# EAGLE schematic darpa-ee-adapter (EAGLE 9.3.2)
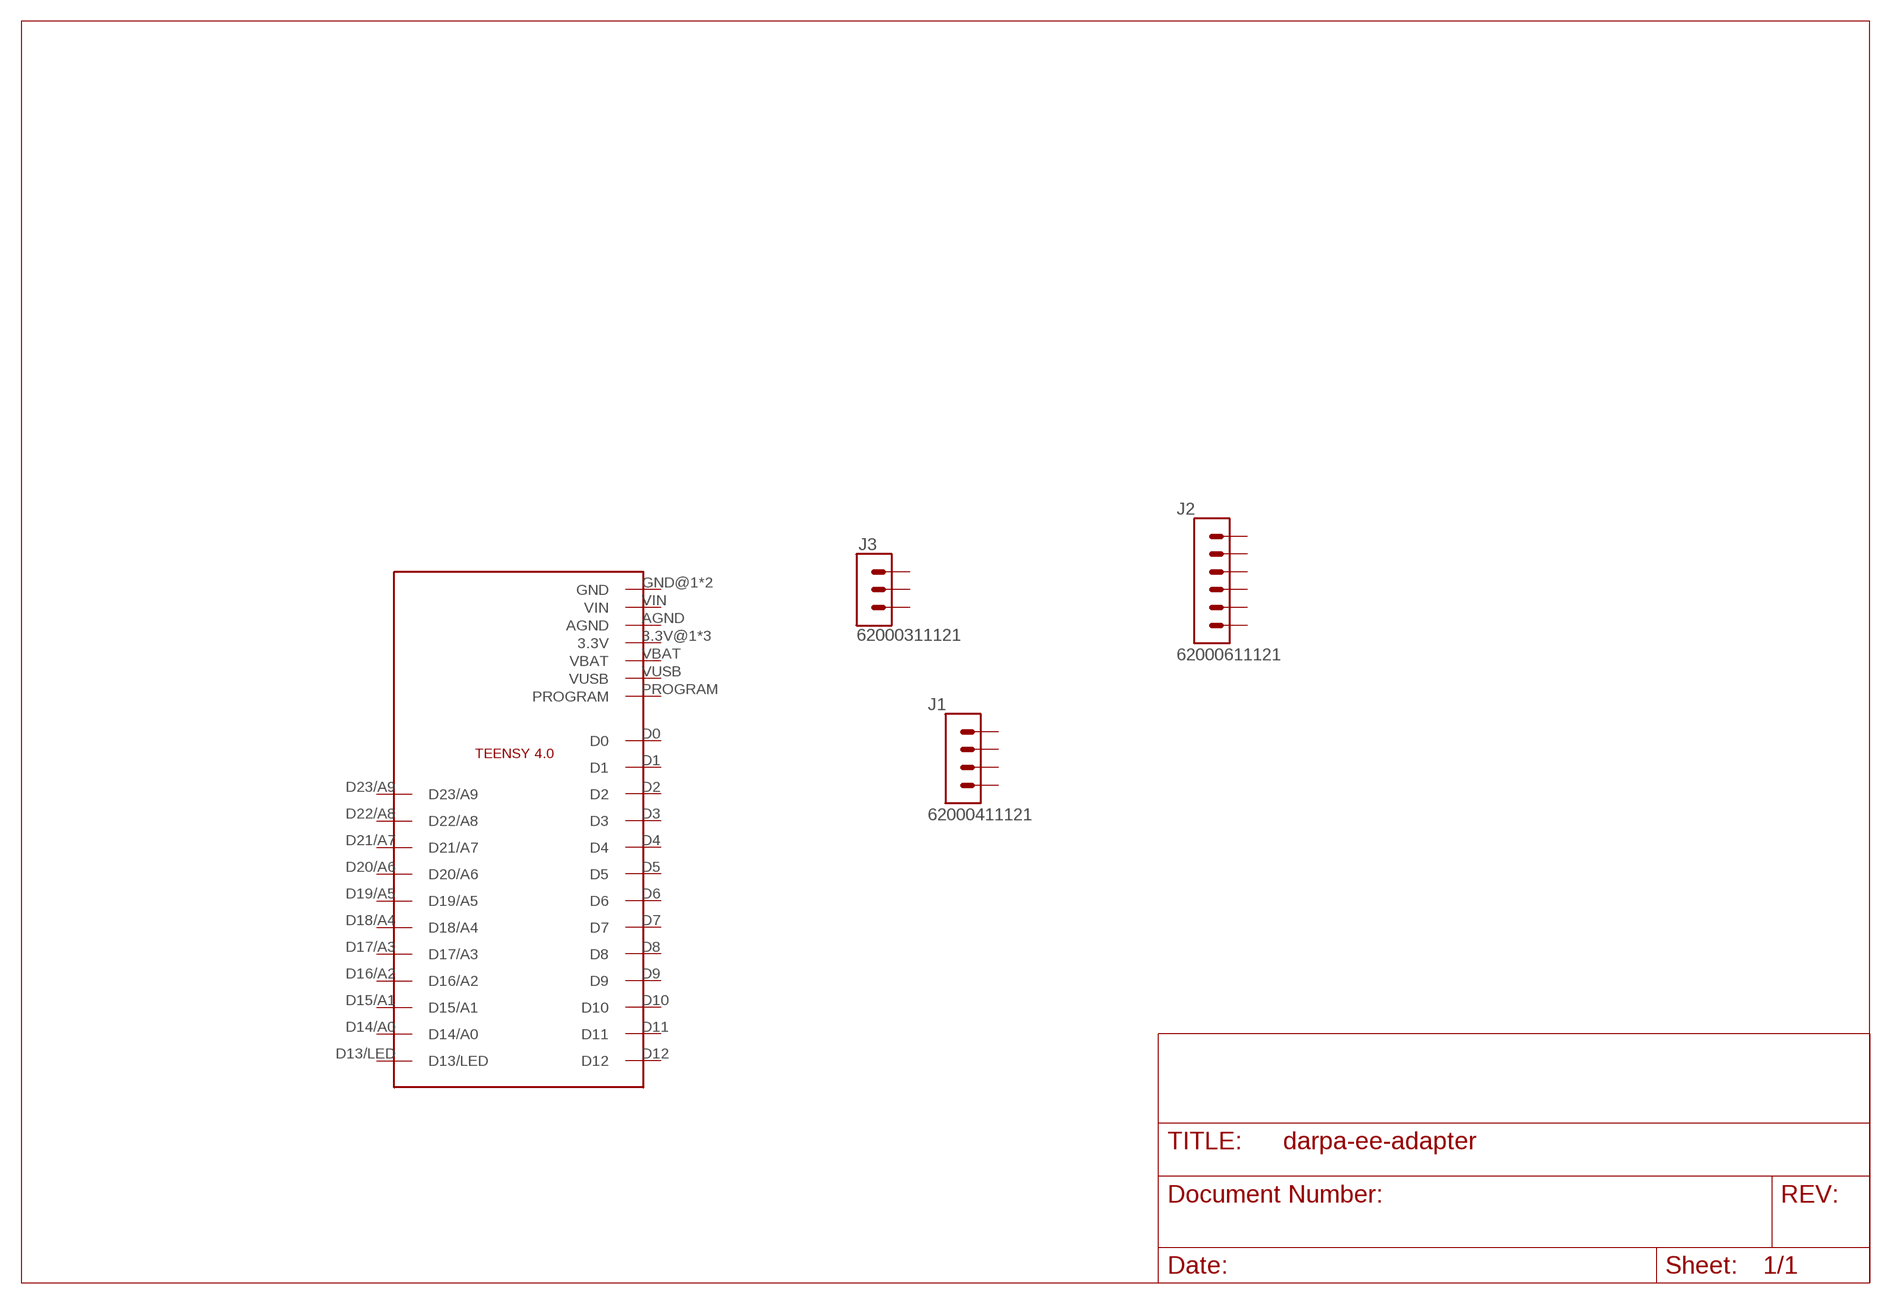
[diagram p0: schematic, sheet 1]

## Parts
J1  62000411121  [62000411121]
J2  62000611121  [62000611121]
J3  62000311121  [62000311121]
U$1  TEENSY4.0  [TEENSY4.0]
Unconnected: J1.1 J1.2 J1.3 J1.4 J2.1 J2.2 J2.3 J2.4 J2.5 J2.6 J3.1 J3.2 J3.3 U$1.3.3V@1(3.3V) U$1.3.3V@2(3.3V) U$1.AGND U$1.D0 U$1.D1 U$1.D2 U$1.D3 U$1.D4 U$1.D5 U$1.D6 U$1.D7 U$1.D8 U$1.D9 U$1.D10 U$1.D11 U$1.D12 U$1.D13/LED U$1.D14/A0 U$1.D15/A1 U$1.D16/A2 U$1.D17/A3 U$1.D18/A4 U$1.D19/A5 U$1.D20/A6 U$1.D21/A7 U$1.D22/A8 U$1.D23/A9 U$1.GND@1(GND) U$1.GND@2(GND) U$1.ON/OFF(3.3V) U$1.PROGRAM U$1.VBAT U$1.VIN U$1.VUSB

## Library data of the parts
J1 = Headers:62000411121: THT Vertical Pin Header WR-PHD, Pitch 2.00 mm, Single Row, 4 pins Manufacturer's datasheet <https://datasheet.octopart.com/62000411121-W%C3%BCrth-Elektronik-datasheet-117282003.pdf>; CREATED_BY: PCBLayout.com; MANUFACTURER: Würth Elektronik; MPN: 62000411121
J2 = Headers:62000611121: THT Vertical Pin Header WR-PHD, Pitch 2.00 mm, Single Row, 6 pins Manufacturer's datasheet <https://datasheet.octopart.com/62000611121-W%C3%BCrth-Elektronik-datasheet-117282008.pdf>; CREATED_BY: PCBLayout.com; MANUFACTURER: Würth Elektronik; MPN: 62000611121
J3 = Headers:62000311121: THT Vertical Pin Header WR-PHD, Pitch 2.00 mm, Single Row, 3 pins Manufacturer's datasheet <https://datasheet.octopart.com/62000311121-W%C3%BCrth-Elektronik-datasheet-117282002.pdf>; CREATED_BY: PCBLayout.com; MANUFACTURER: Würth Elektronik; MPN: 62000311121
U$1 = Teensy4.0:TEENSY4.0